# Altium schematic sheet Linelance_Schematic_page1.SchDoc
size A4; Author: Dubatouka U.V.; DocumentNumber: 1; SheetNumber: 1; SheetTotal: 3; Scale: 1:1
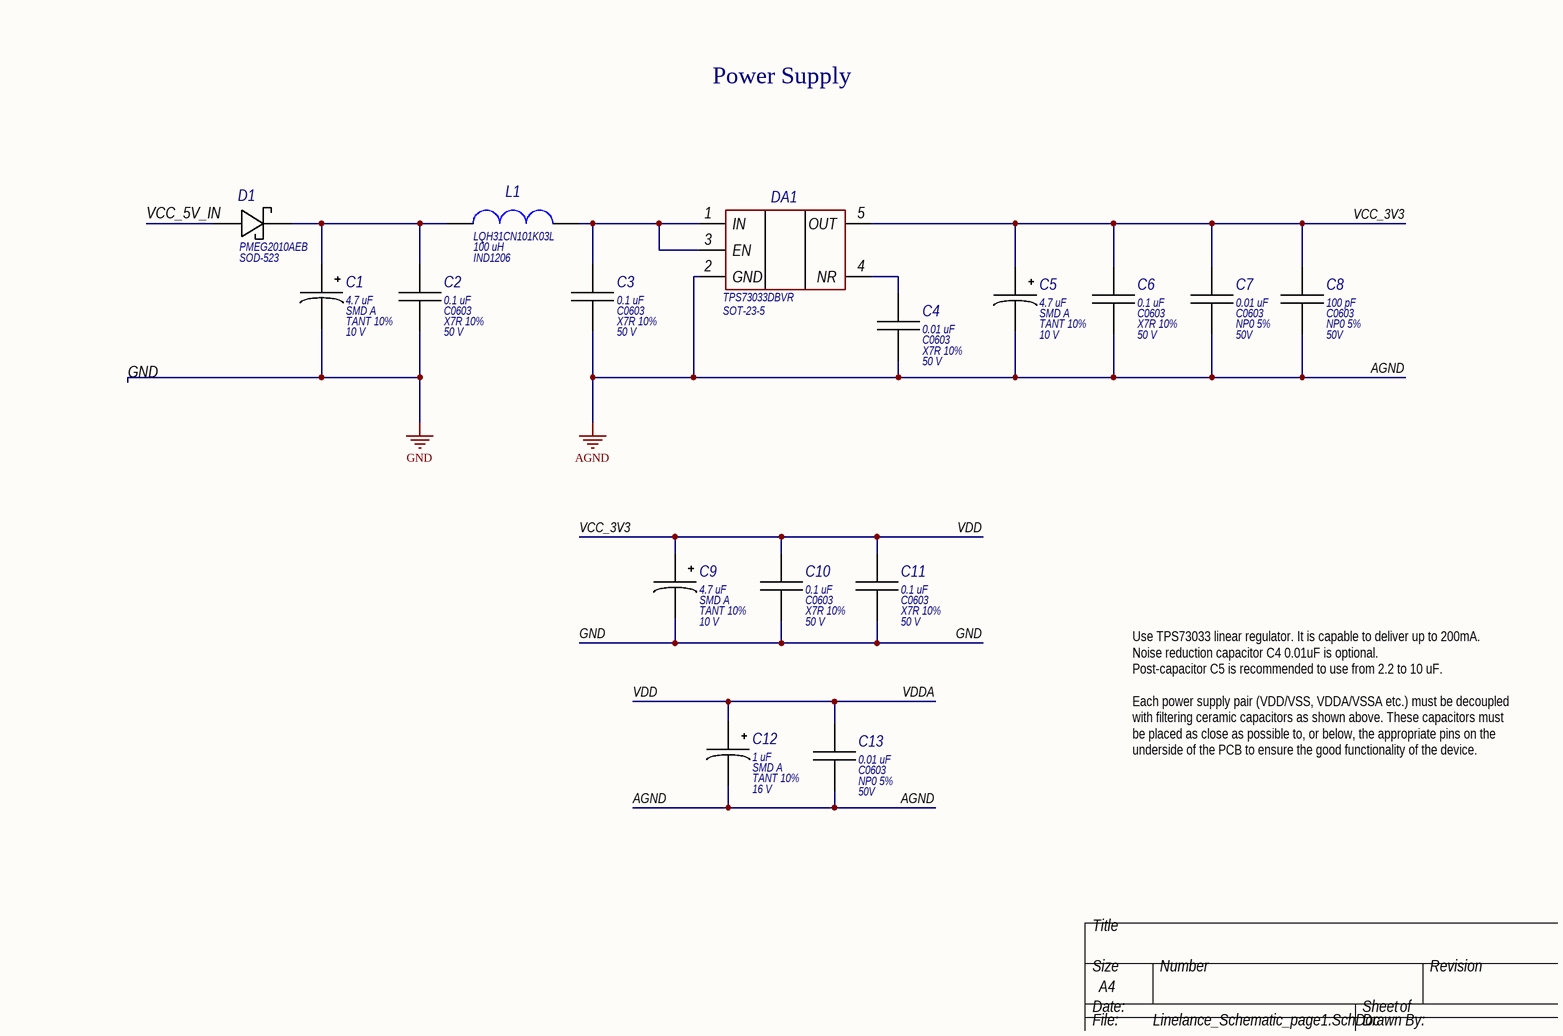
[diagram p0: Linelance_Schematic_page1.SchDoc]

## Parts
C1  Case: SMD A  Model: TANT 10%  Voltage: 10 V  [TANT-A]  (hidden comment: 4.7 uF)
C2  Model: X7R 10%  Voltage: 50 V  [C0603]  (hidden comment: 0.1 uF)
C3  Model: X7R 10%  Voltage: 50 V  [C0603]  (hidden comment: 0.1 uF)
C4  Model: X7R 10%  Voltage: 50 V  [C0603]  (hidden comment: 0.01 uF)
C5  Case: SMD A  Model: TANT 10%  Voltage: 10 V  [TANT-A]  (hidden comment: 4.7 uF)
C6  Model: X7R 10%  Voltage: 50 V  [C0603]  (hidden comment: 0.1 uF)
C7  Case: С0603  Model: NP0 5%  Voltage: 50V  [C0603]  (hidden comment: 0.01 uF)
C8  Case: С0603  Model: NP0 5%  Voltage: 50V  [C0603]  (hidden comment: 100 pF)
C9  Case: SMD A  Model: TANT 10%  Voltage: 10 V  [TANT-A]  (hidden comment: 4.7 uF)
C10  Model: X7R 10%  Voltage: 50 V  [C0603]  (hidden comment: 0.1 uF)
C11  Model: X7R 10%  Voltage: 50 V  [C0603]  (hidden comment: 0.1 uF)
C12  Case: SMD A  Model: TANT 10%  Voltage: 16 V  [TANT-A]  (hidden comment: 1 uF)
C13  Case: С0603  Model: NP0 5%  Voltage: 50V  [C0603]  (hidden comment: 0.01 uF)
D1  PMEG2010AEB  [SOD-523]
DA1  Model: TPS73033DBVR  [SOT-23-5]
L1  Model: LQH31CN101K03L  [IND1206]  (hidden comment: 100 uH)

## Nets
AGND: C3.2 C4.2 C5.2 C6.2 C7.2 C8.2 C12.2 C13.2 DA1.2(GND)
GND: C1.2 C2.2 C9.2 C10.2 C11.2
VCC_3V3: C5.1 C6.1 C7.1 C8.1 C9.1 C10.1 C11.1 C12.1 C13.1 DA1.5(OUT)  [also labelled VDD, VDDA]
VCC_5V_IN: D1.2
NetC1_1: C1.1 C2.1 D1.1 L1.1
NetC3_1: C3.1 DA1.1(IN) DA1.3(EN) L1.2
NetC4_1: C4.1 DA1.4(NR)

## Notes on the sheet
- Power Supply
- Use TPS73033 linear regulator. It is capable to deliver up to 200mA.
  Noise reduction capacitor C4 0.01uF is optional.
  Post-capacitor C5 is recommended to use from 2.2 to 10 uF.
  Each power supply pair (VDD/VSS, VDDA/VSSA etc.) must be decoupled with filtering ceramic capacitors as shown above. These capacitors must be placed as close as possible to, or below, the appropriate pins on the underside of the PCB to ensure the good functionality of the device.
- Перв. примен.
- Справ. №
- Подп. и дата
- Инв. № дубл.
- Взам. инв. №
- Разраб.
- Изм.
- Лист
- № докум.
- Подп.
- Дата
- Лит.
- Масса
- Масштаб
- Пров.
- Т.контр.
- Листов
- Инв. № подл.
- Утв.
- Н.контр.
- 2.106-A3
- Копировал
- Формат А3

## Library data of the parts
C1 C5 C9 C12 = Capasitor_Tantalum: Manufacturer: China
  C1 C5 C9: Value: 4.7 uF; HelpURL: https://www.chipdip.by/product0/6038
  C12: Value: 1 uF; HelpURL: https://www.chipdip.by/product0/19661
C2-C4 C6-C8 C10 C11 C13 = Capasitor_ceramic: Manufacturer: Murata Manufacturing
  C2 C3 C6 C10 C11: Value: 0.1 uF; Case: C0603; HelpURL: https://www.chipdip.by/product/grm188r71h104k
  C4: Value: 0.01 uF; Case: C0603; HelpURL: https://www.chipdip.by/product/grm188r71h103k
  C7 C13: Value: 0.01 uF; HelpURL: https://www.chipdip.by/product/grm188r71h103k
  C8: Value: 100 pF; HelpURL: https://www.chipdip.by/product/grm1885c1h101j
D1 = Diode Schottky: Manufacturer: Nexperia; Model: PMEG2010AEB; Case: SOD-523; HelpURL: https://www.chipdip.by/product/pmeg2010aeb.115
DA1 = TPS73033DBV: IC REG LINEAR 3.3V 200MA SOT 23-5; Manufacturer: Texas Instruments; Case: SOT-23-5; HelpURL: https://www.chipdip.by/product/tps73033dbvr-2
L1 = Inductivity: Manufacturer: Murata Manufacturing; HelpURL: https://www.chipdip.by/product/lqh31cn101k03l; Case: IND1206; Value: 100 uH